# Altium schematic sheet OMT_SFR_Ports.SchDoc
size A; Organization: Altium Limited; Address1: L3, 12a Rodborough Rd; Address2: Frenchs Forest; Address3: NSW; Address4: Australia 2086; DocumentNumber: 3; SheetNumber: 3; SheetTotal: 5
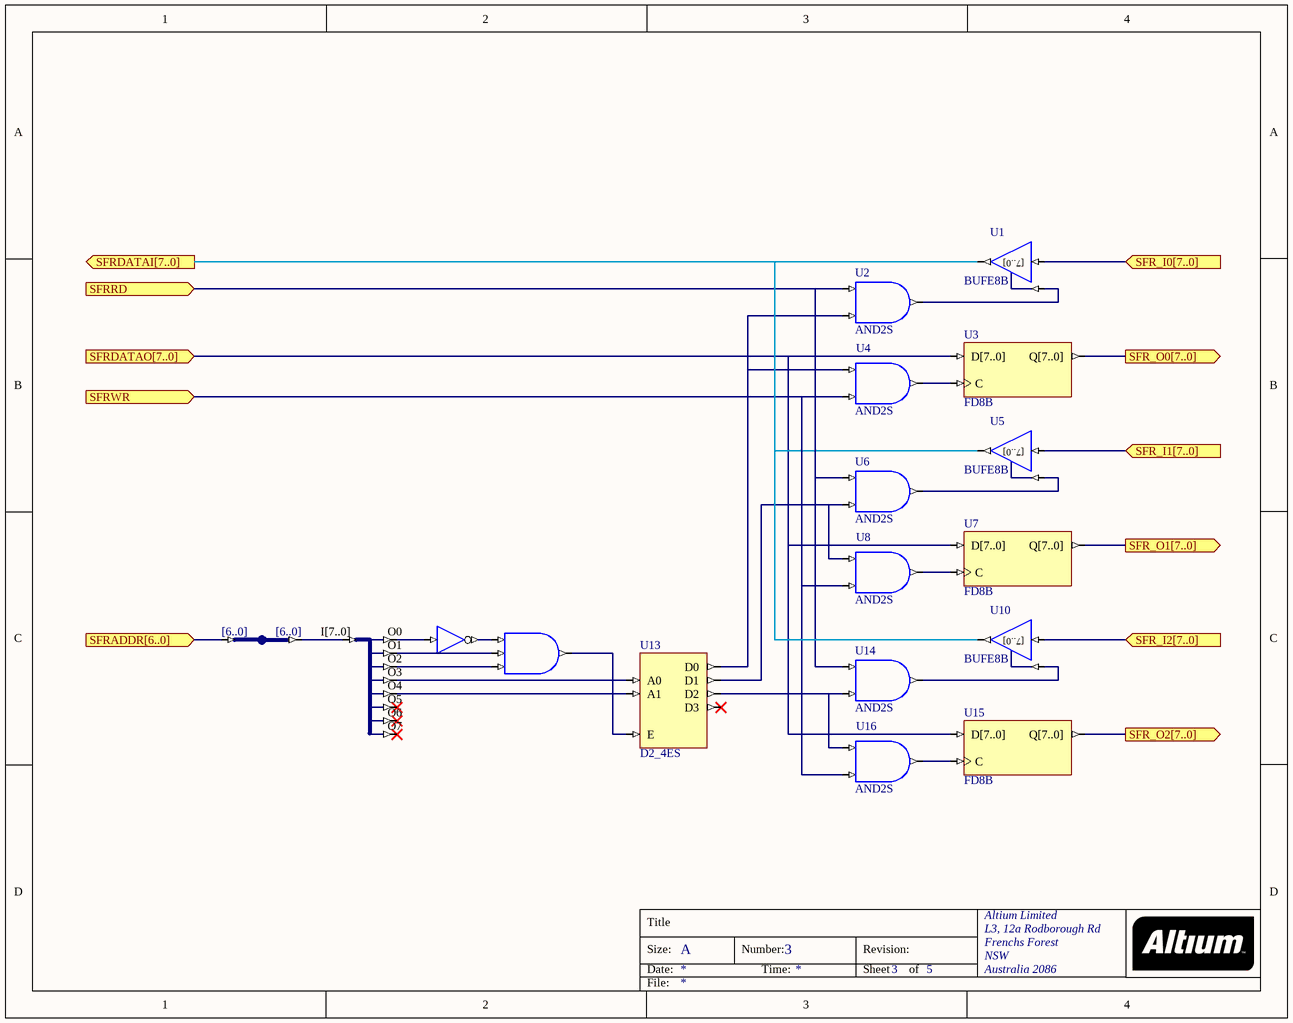
[diagram p0: OMT_SFR_Ports.SchDoc]

## Parts
JB_S1  IndexA: [6..0]  (hidden comment: JB)
U1  BUFE8B
U2  AND2S
U3  FD8B
U4  AND2S
U5  BUFE8B
U6  AND2S
U7  FD8B
U8  AND2S
U9  INV  (value not drawn)
U10  BUFE8B
U11  AND3S  (value not drawn)
U12  J8B_8S  (value not drawn)
U13  D2_4ES
U14  AND2S
U15  FD8B
U16  AND2S

## Ports
SFR_I0[7..0] (in), SFR_I1[7..0] (in), SFR_I2[7..0] (in), SFR_O0[7..0] (out), SFR_O1[7..0] (out), SFR_O2[7..0] (out), SFRADDR[6..0] (in), SFRDATAI[7..0] (out), SFRDATAO[7..0] (in), SFRRD (in), SFRWR (in)

## Nets
SFR_I0[7..0]: U1.I[7..0] ; port SFR_I0[7..0]
SFR_I1[7..0]: U5.I[7..0] ; port SFR_I1[7..0]
SFR_I2[7..0]: U10.I[7..0] ; port SFR_I2[7..0]
SFR_O0[7..0]: U3.Q[7..0] ; port SFR_O0[7..0]
SFR_O1[7..0]: U7.Q[7..0] ; port SFR_O1[7..0]
SFR_O2[7..0]: U15.Q[7..0] ; port SFR_O2[7..0]
SFRADDR[6..0]: JB_S1.A[0..0](IA[0..0]) ; port SFRADDR[6..0]
SFRDATAI[7..0]: U1.O[7..0] U5.O[7..0] U10.O[7..0] ; port SFRDATAI[7..0]
SFRDATAO[7..0]: U3.D[7..0] U7.D[7..0] U15.D[7..0] ; port SFRDATAO[7..0]
SFRRD: U2.I0 U6.I0 U14.I0 ; port SFRRD
SFRWR: U4.I1 U8.I1 U16.I1 ; port SFRWR
NetJB_S1_B[0..0]: JB_S1.B[0..0] U12.I[7..0]
NetU1_E: U1.E U2.O
NetU2_I1: U2.I1 U4.I0 U13.D0
NetU3_C: U3.C U4.O
NetU5_E: U5.E U6.O
NetU6_I1: U6.I1 U8.I0 U13.D1
NetU7_C: U7.C U8.O
NetU9_I: U9.I U12.O0
NetU9_O: U9.O U11.I0
NetU10_E: U10.E U14.O
NetU11_I1: U11.I1 U12.O1
NetU11_I2: U11.I2 U12.O2
NetU11_O: U11.O U13.E
NetU12_O3: U12.O3 U13.A0
NetU12_O4: U12.O4 U13.A1
NetU13_D2: U13.D2 U14.I1 U16.I0
NetU15_C: U15.C U16.O

Not connected (* = marked no-connect by the designer): U12 O5* O6* O7*; U13 D3*

## Notes on the sheet
- Title
- Size:
- Date:
- A
- Number:
- Time:
- Revision:
- Sheet
- of
- File:
- (in symbol BUFE8B) [7..0]

## Library data of the parts
JB_S1 = JB: System Joiner; ArchiveName: GENERIC; Published: 7-Nov-2003; Publisher: Altium Limited; Core Revision: 1.00.00; IndexB: [6..0]
U1 U5 U10 = BUFE8B: 8-Bit 3-state Buffer with Active High Enable, Bus Version; Xilinx Equivalent: BUFE8; ArchiveName: GENERIC; Published: 7-Nov-2003; Publisher: Altium Limited; Core Revision: 1.00.00
U2 U4 U6 U8 U14 U16 = AND2S: 2-Input AND Gate, Single Pin Version; Xilinx Equivalent: AND2; ArchiveName: GENERIC; Published: 7-Nov-2003; Publisher: Altium Limited; Core Revision: 1.00.00
U3 U7 U15 = FD8B: 8-Bit D-Type Flip-Flop, Bus Version; Xilinx Equivalent: FD8; ArchiveName: GENERIC; Published: 7-Nov-2003; Publisher: Altium Limited; Core Revision: 1.00.00
U9 = INV: Inverter; ArchiveName: GENERIC; Published: 7-Nov-2003; Publisher: Altium Limited; Xilinx Equivalent: INV; Core Revision: 1.00.00
U11 = AND3S: 3-Input AND Gate, Single Pin Version; Xilinx Equivalent: AND3; ArchiveName: GENERIC; Published: 7-Nov-2003; Publisher: Altium Limited; Core Revision: 1.00.00
U12 = J8B_8S: 8-Bit input bus to 8 single pin outputs; FunctionalClass: Bus Joiner; PortSize: 8; ArchiveName: GENERIC; VHDLIB_SIM: GENERIC_LIB; Published: 29-Jan-2004; Publisher: Altium Limited; LastRevisionNo: 1.00.00; HelpURL: CR0118 FPGA Generic Library Guide.pdf#page=303; ComponentLink1URL: CR0126 FPGA Bus Joiner Resource Usage.pdf#page=27; ComponentLink1Description: Core &Resource Usage
U13 = D2_4ES: Binary 2- to 4-Bit Decoder with Enable, Single Pin Version; XilinxEquivalent: D2_4E; SubClass: n_m; Enable: High; PortSize: 4; ArchiveName: GENERIC; VHDLIB_SIM: GENERIC_LIB; Published: 29-Jan-2004; Publisher: Altium Limited; LastRevisionNo: 1.00.00; HelpURL: CR0118 FPGA Generic Library Guide.pdf#page=158; ComponentLink1URL: CR0131 FPGA Decoder Resource Usage.pdf#page=4; ComponentLink1Description: Core &Resource Usage; FunctionalClass: Decoder; PortStyle: Single Pin Version